# Altium schematic sheet Common.SchDoc
size A4; Organization: Altium Limited; Address1: 3 Minna Close; Address2: Belrose; Address3: NSW 2085; Address4: Australia
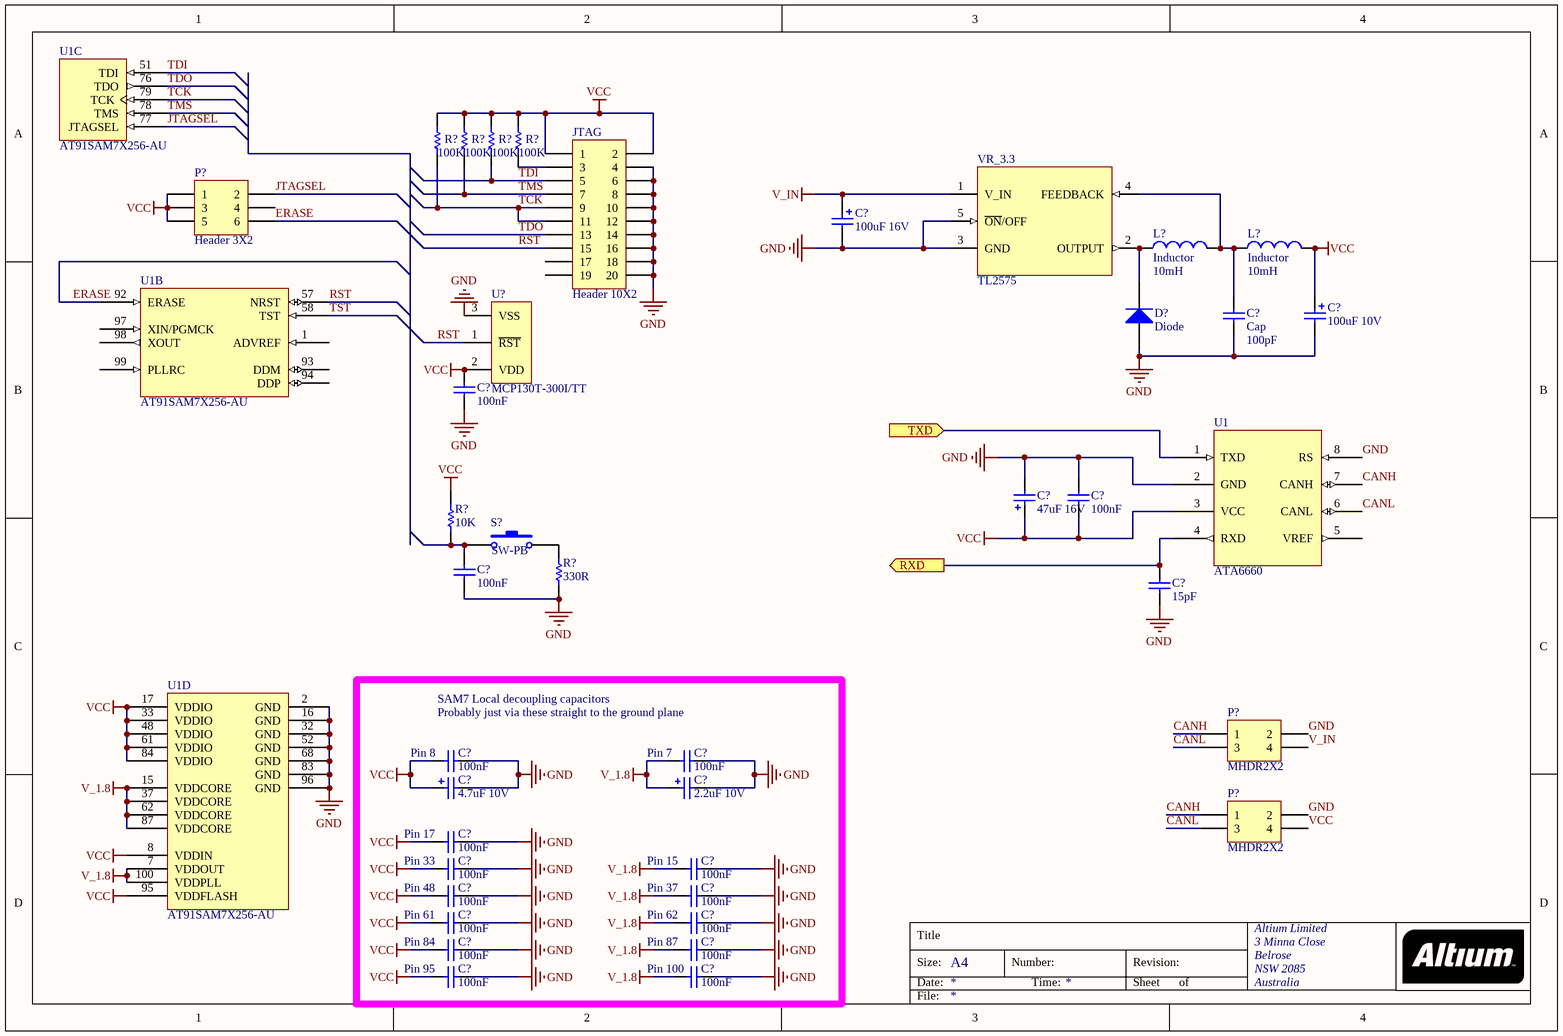
[diagram p0: Common.SchDoc]

## Parts
(Parts that share a designator on the sheet are numbered #1, #2 ... from top to bottom, then left to right.)
C?#1  100uF 16V  [TANT7343]
C?#2  Cap  value 100pF  [RAD-0.3]
C?#3  100uF 10V  [TANT6032]
C?#4  100nF  [CC0603]
C?#5  47uF 16V  [TANT7343]
C?#6  100nF  [CC0603]
C?#7  100nF  [CC0603]
C?#8  15pF  [CC0603]
C?#9  100nF  [CC0603]
C?#10  100nF  [CC0603]
C?#11  4.7uF 10V  [TANT3216]
C?#12  2.2uF 10V  [TANT3216]
C?#13  100nF  [CC0603]
C?#14  100nF  [CC0603]
C?#15  100nF  [CC0603]
C?#16  100nF  [CC0603]
C?#17  100nF  [CC0603]
C?#18  100nF  [CC0603]
C?#19  100nF  [CC0603]
C?#20  100nF  [CC0603]
C?#21  100nF  [CC0603]
C?#22  100nF  [CC0603]
C?#23  100nF  [CC0603]
D?  Diode  [DSO-C2/X3.3]
JTAG  Header 10X2  [HDR2X10]
L?#1  Inductor  value 10mH  [INDC1005AL]
L?#2  Inductor  value 10mH  [INDC1005AL]
P?#1  Header 3X2  [HDR2X3]
P?#2  MHDR2X2  [MHDR2X2]
P?#3  MHDR2X2  [MHDR2X2]
R?#1  100K  [R0603]
R?#2  100K  [R0603]
R?#3  100K  [R0603]
R?#4  100K  [R0603]
R?#5  10K  [R0603]
R?#6  330R  [R0603]
S?  SW-PB  [SPST-2]
U1#1  AT91SAM7X256-AU  [LQFP100_N]  (parts B,C,D of 4)
U1#2  ATA6660  [SOIC127P600X150-8N]
U?  MCP130T-300I/TT  [SOT-23-TT3_N]
VR_3.3  TL2575  [TO170P1524X483-6N]

## Ports
RXD (out), TXD (in)

## Nets
GND: C?#1.2 C?#2.2 C?#3.2 C?#4.2 C?#5.2 C?#6.2 C?#7.2 C?#8.1 C?#9.2 C?#10.2 C?#11.2 C?#12.2 C?#13.2 C?#14.2 C?#15.2 C?#16.2 C?#17.2 C?#18.2 C?#19.2 C?#20.2 C?#21.2 C?#22.2 C?#23.2 D?.1(A) JTAG.4 JTAG.6 JTAG.8 JTAG.10 JTAG.12 JTAG.14 JTAG.16 JTAG.18 JTAG.20 P?#2.2 P?#3.2 R?#6.1 U1#1.2(GND) U1#1.16(GND) U1#1.32(GND) U1#1.52(GND) U1#1.68(GND) U1#1.83(GND) U1#1.96(GND) U1#2.2(GND) U1#2.8(RS) U?.3(VSS) VR_3.3.3(GND) VR_3.3.5(~{ON}/OFF)
V_1.8: C?#10.1 C?#12.1 C?#15.1 C?#17.1 C?#19.1 C?#21.1 C?#23.1 U1#1.7(VDDOUT) U1#1.15(VDDCORE) U1#1.37(VDDCORE) U1#1.62(VDDCORE) U1#1.87(VDDCORE) U1#1.100(VDDPLL)
V_IN: C?#1.1 P?#2.4 VR_3.3.1(V_IN)
VCC: C?#3.1 C?#4.1 C?#5.1 C?#6.1 C?#9.1 C?#11.1 C?#13.1 C?#14.1 C?#16.1 C?#18.1 C?#20.1 C?#22.1 JTAG.1 JTAG.2 L?#2.2 P?#1.1 P?#1.3 P?#1.5 P?#3.4 R?#1.1 R?#2.1 R?#3.1 R?#4.1 R?#5.2 U1#1.8(VDDIN) U1#1.17(VDDIO) U1#1.33(VDDIO) U1#1.48(VDDIO) U1#1.61(VDDIO) U1#1.84(VDDIO) U1#1.95(VDDFLASH) U1#2.3(VCC) U?.2(VDD)
CANH: P?#2.1 P?#3.1 U1#2.7(CANH)
CANL: P?#2.3 P?#3.3 U1#2.6(CANL)
ERASE: P?#1.6 U1#1.92(ERASE)
JTAGSEL: P?#1.2 U1#1.77(JTAGSEL)
RST: JTAG.15 U1#1.57(NRST) U?.1(~{RST})
RXD: C?#8.2 U1#2.4(RXD) ; port RXD
TCK: JTAG.9 JTAG.11 R?#1.2 U1#1.79(TCK)
TDI: JTAG.5 R?#3.2 U1#1.51(TDI)
TDO: JTAG.13 U1#1.76(TDO)
TMS: JTAG.7 R?#2.2 U1#1.78(TMS)
TST: U1#1.58(TST)
TXD: U1#2.1(TXD) ; port TXD
NetC?#2_1: C?#2.1 L?#1.2 L?#2.1 VR_3.3.4(FEEDBACK)
NetC?#7_1: C?#7.1 R?#5.1 S?.1
NetD?_2: D?.2(K) L?#1.1 VR_3.3.2(OUTPUT)
NetJTAG_3: JTAG.3 R?#4.2
NetR?#6_2: R?#6.2 S?.2

Not connected (* = marked no-connect by the designer): JTAG 17 19; P?#1 4; U1#1 1(ADVREF) 93(DDM) 94(DDP) 97(XIN/PGMCK) 98(XOUT) 99(PLLRC); U1#2 5(VREF)

## Notes on the sheet
- SAM7 Local decoupling capacitors
- (near C?#9) Probably just via these straight to the ground plane
- (near C?#9) Pin 8
- (near C?#10) Pin 7
- (near C?#13) Pin 17
- (near C?#14) Pin 33
- (near C?#16) Pin 48
- (near C?#18) Pin 61
- (near C?#15) Pin 15
- (near C?#17) Pin 37
- (near C?#19) Pin 62
- (near C?#20) Pin 84
- (near C?#22) Pin 95
- (near C?#21) Pin 87
- (near C?#23) Pin 100
- Title
- Size:
- Date:
- A4
- Number:
- Time:
- Revision:
- Sheet
- of
- File:

## Library data of the parts
C?#1 = TANT100uF_16V_7343: SM Tantalum Cap; Supplier_Component_Code: RZ-6577; published: 12/03/2007 11:34:36 a.m.; Supplier_Name: Soanar Plus; price: 5.45; value: 100uF 16V; Part Number: TANT100uF_16V_7343; Component Kind: Standard; Component Type: Standard; Designator: TANT100uF_16V_7343; Pin Count: 2
C?#2 = Cap: Capacitor; Published: 8-Jun-2000; LatestRevisionDate: 17-Jul-2002; LatestRevisionNote: Re-released for DXP Platform.; PackageReference: RAD-0.3; Publisher: Altium Limited
C?#3 = TANT100uF_10V_6032: SM Tantalum Cap; Supplier_Component_Code: RZ-6556; published: 12/03/2007 11:34:36 a.m.; Supplier_Name: Soanar Plus; price: 5.45; value: 100uF 10V; Part Number: TANT100uF_10V_6032; Component Kind: Standard; Component Type: Standard; Designator: TANT100uF_10V_6032; Pin Count: 2
C?#4 C?#6 C?#7 C?#9 C?#10 C?#13-C?#23 = 100nF_CC0603: 0603 Capacitor; Supplier_Component_Code: RC-P100; published: 28/03/2007 10:54:57 a.m.; Supplier_Name: Soanar Plus; price: 0.09; value: 100nF; Part Number: 100nF_CC0603; Component Kind: Standard; Component Type: Standard; Designator: 100nF_CC0603; Pin Count: 2
C?#5 = TANT47uF_16V_7343: SM Tantalum Cap; Supplier_Component_Code: RZ-6574; published: 12/03/2007 11:34:36 a.m.; Supplier_Name: Soanar Plus; price: 1.9; value: 47uF 16V; Part Number: TANT47uF_16V_7343; Component Kind: Standard; Component Type: Standard; Designator: TANT47uF_16V_7343; Pin Count: 2
C?#8 = 15pF_CC0603: 0603 Capacitor; Supplier_Component_Code: RC-P051; published: 28/03/2007 10:54:57 a.m.; Supplier_Name: Soanar Plus; price: 0.06; value: 15pF; Part Number: 15pF_CC0603; Component Kind: Standard; Component Type: Standard; Designator: 15pF_CC0603; Pin Count: 2
C?#11 = TANT4.7uF_10V_3216: SM Tantalum Cap; Supplier_Component_Code: RZ-6547; published: 12/03/2007 11:34:36 a.m.; Supplier_Name: Soanar Plus; price: 1.7; value: 4.7uF 10V; Part Number: TANT4.7uF_10V_3216; Component Kind: Standard; Component Type: Standard; Designator: TANT4.7uF_10V_3216; Pin Count: 2
C?#12 = TANT2.2uF_10V_3216: SM Tantalum Cap; Supplier_Component_Code: RZ-6544; published: 12/03/2007 11:34:36 a.m.; Supplier_Name: Soanar Plus; price: 1.7; value: 2.2uF 10V; Part Number: TANT2.2uF_10V_3216; Component Kind: Standard; Component Type: Standard; Designator: TANT2.2uF_10V_3216; Pin Count: 2
D? = Diode: Default Diode; Published: 8-Jun-2000; LatestRevisionDate: 17-Jul-2002; LatestRevisionNote: Re-released for DXP Platform.; PackageVersion: Sep-1996; PackageReference: SMC; Publisher: Altium Limited; Code_JEDEC: DO-214-AB
JTAG = Header 10X2: Header, 10-Pin, Dual row; LatestRevisionDate: 17-Jul-2002; LatestRevisionNote: Re-released for DXP Platform.; Publisher: Altium Limited
L?#1 L?#2 = Inductor: Code_IEC: 1005; Published: 8-Jun-2000; LatestRevisionDate: 29-May-2009; LatestRevisionNote: IPC-7351 Footprint Added.; PackageReference: 0402-A; Publisher: Altium Limited; PackageDescription: Chip Inductor; Code_JEITA: 0402
P?#1 = Header 3X2: Header, 3-Pin, Dual row; LatestRevisionDate: 17-Jul-2002; LatestRevisionNote: Re-released for DXP Platform.; Publisher: Altium Limited
P?#2 P?#3 = MHDR2X2: Header, 2-Pin, Dual row; LatestRevisionDate: 17-Jul-2002; LatestRevisionNote: Re-released for DXP Platform.; Publisher: Altium Limited
R?#1-R?#4 = 100K_R0603: 0603 Resistor; ECE_Component_Code: 100K_R0603; value: 100K; Supplier_Component_Code: RS-S121; published: 12/03/2007 11:34:34 a.m.; Supplier_Name: Soanar Plus; price: 0.08; Part Number: 100K_R0603; Component Kind: Standard; Component Type: Standard; Designator: 100K_R0603; Pin Count: 2
R?#5 = 10K_R0603: 0603 Resistor; ECE_Component_Code: 10K_R0603; value: 10K; Supplier_Component_Code: RS-S097; published: 12/03/2007 11:34:34 a.m.; Supplier_Name: Soanar Plus; price: 0.08; Part Number: 10K_R0603; Component Kind: Standard; Component Type: Standard; Designator: 10K_R0603; Pin Count: 2
R?#6 = 330R_R0603: 0603 Resistor; ECE_Component_Code: 330R_R0603; value: 330R; Supplier_Component_Code: RS-S061; published: 12/03/2007 11:34:34 a.m.; Supplier_Name: Soanar Plus; price: 0.08; Part Number: 330R_R0603; Component Kind: Standard; Component Type: Standard; Designator: 330R_R0603; Pin Count: 2
S? = SW-PB: Switch; Published: 24-Mar-1999; LatestRevisionDate: 17-Jul-2002; LatestRevisionNote: Re-released for DXP Platform.; PackageReference: SPST-2; Publisher: Altium Limited
U1#1 = AT91SAM7X256-AU: Smart ARM Microcontroller, ARM7TDMI 32-Bit RISC CPU, 256KB Flash and 64KB SRAM, 100-Pin LQFP, Industrial, Pb-Free; Published: 16-Oct-2006; DatasheetVersion: 17-Oct-2005; PackageVersion: Apr-2006; PackageReference: LQFP100; Publisher: Altium Limited; PackageDescription: 100-Pin Thin Quad Flat Pack 0.5 mm Pitch; Code_JEDEC: MS-026-BED; ComponentLink1Description: Manufacturer Link; ComponentLink1URL: http://www.atmel.com; ComponentLink2Description: Datasheet; ComponentLink2URL: http://www.atmel.com/dyn/resources/prod_documents/6120s.pdf
U? = MCP130T-300I/TT: Microcontroller Supervisory Circuit with Open Drain Output, 3-Pin SOT-23, Industrial Temperature, Tape and Reel; FirstPublished: 29-Jan-2009; DatasheetVersion: revD, 2001; PackageVersion: revBB, Aug-2009; PackageReference: SOT-23-TT3; Publisher: Altium Limited; PackageDescription: 3-Lead Plastic Small Outline Transistor (TT) [SOT-23]; Supplier 1: Digi-Key; Supplier Part Number 1: MCP130T-300I/TTTR-ND; Supplier 2: Digi-Key; Supplier Part Number 2: MCP130T-300I/TTCT-ND; Supplier 3: Digi-Key; Supplier Part Number 3: MCP130T-300I/TTDKR-ND; Supplier 4: Farnell; Supplier Part Number 4: 1332070; Supplier 5: Newark; Supplier Part Number 5: 19C7176; Code_IPC: SOT23-3; ComponentLink1Description: Datasheet; ComponentLink1URL: http://ww1.microchip.com/downloads/en/DeviceDoc/11184d.pdf; ComponentLink2Description: Packaging Specification; ComponentLink2URL: http://www.microchip.com/stellent/groups/techpub_sg/documents/packagingspec/en012702.pdf; ComponentLink3Description: Microchip.com Home; ComponentLink3URL: http://www.microchip.com/